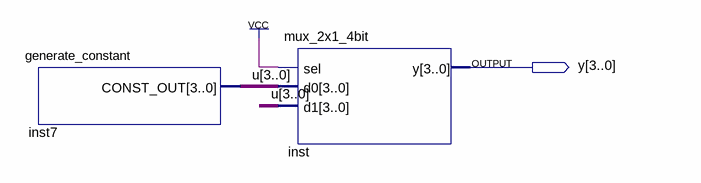
[diagram p0: schematic sheet]
// Quartus schematic Block1.bdf as structural Verilog: 2 symbols, 1 pins
module Block1 (
  output [3:0] y
);

  wire [3:0] u;

  generate_constant inst7 (.CONST_OUT(u));
  mux_2x1_4bit inst (.sel(1'b1), .d0(u), .d1(u), .y(y));
endmodule
